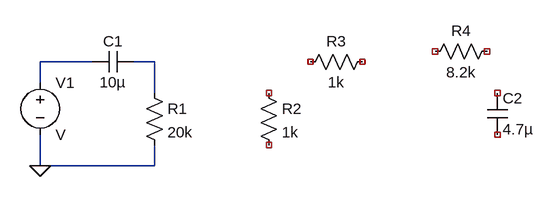
[diagram p0: schematic heartbeatFilter.asc]
heartbeatFilter.asc, the LTspice schematic file:
Version 4
SHEET 1 880 680
WIRE 144 96 64 96
WIRE 240 96 208 96
WIRE 64 128 64 96
WIRE 240 144 240 96
WIRE 64 256 64 208
WIRE 240 256 240 224
WIRE 240 256 64 256
FLAG 64 256 0
SYMBOL voltage 64 112 R0
SYMATTR InstName V1
SYMBOL cap 208 80 R90
WINDOW 0 0 32 VBottom 2
WINDOW 3 32 32 VTop 2
SYMATTR InstName C1
SYMATTR Value 10µ
SYMBOL res 224 128 R0
SYMATTR InstName R1
SYMATTR Value 20k
SYMBOL res 400 128 R0
SYMATTR InstName R2
SYMATTR Value 1k
SYMBOL res 576 80 R90
WINDOW 0 0 56 VBottom 2
WINDOW 3 32 56 VTop 2
SYMATTR InstName R3
SYMATTR Value 1k
SYMBOL cap 752 144 R0
SYMATTR InstName C2
SYMATTR Value 4.7µ
SYMBOL res 768 64 R90
WINDOW 0 0 56 VBottom 2
WINDOW 3 32 56 VTop 2
SYMATTR InstName R4
SYMATTR Value 8.2k

The netlist it stands for:
* heartbeatFilter.asc
V1 N001 0 V
C1 N002 N001 10µ
R1 N002 0 20k
R2 NC_01 NC_02 1k
R3 NC_03 NC_04 1k
C2 NC_05 NC_06 4.7µ
R4 NC_07 NC_08 8.2k
.backanno
.end